# Altium project Cape.PrjPcb (part 3 of 3)
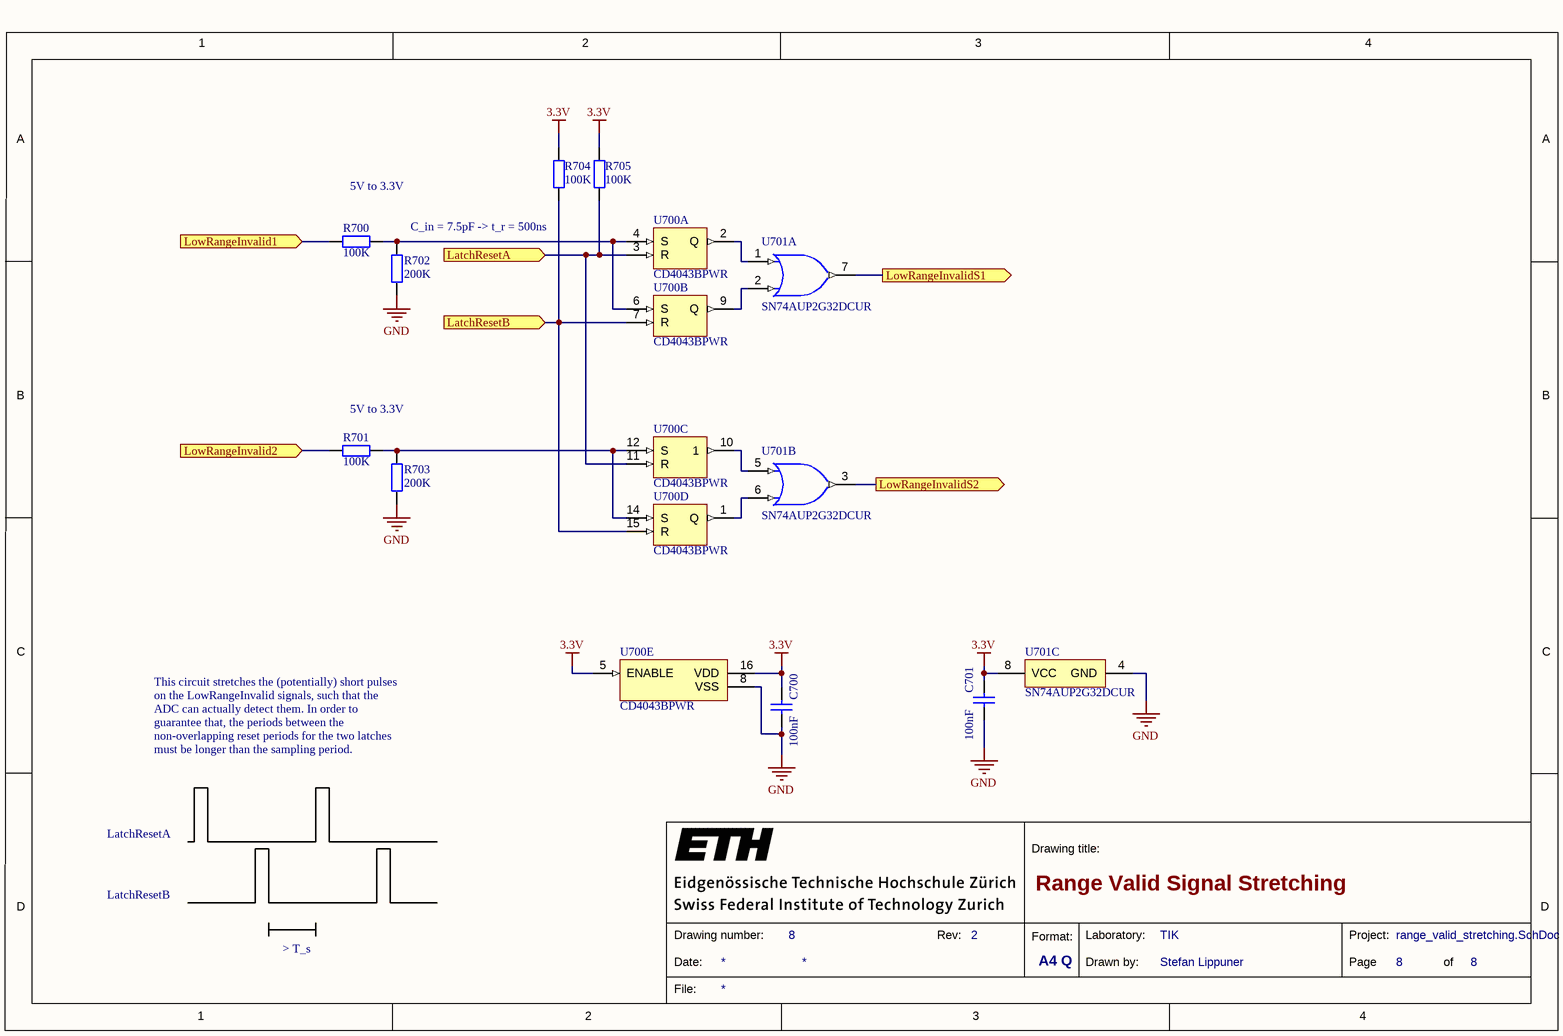
[diagram p8: range_valid_stretching.SchDoc]

## Nets that join several sheets
3.3V: ADC 1 (5 pins), psu (TP415.1), cape (14 pins), ADC 2 (5 pins), Digital Channels 1 & 2 (R600_1.2 R602_1.2), Digital Channels 3 & 4 (R600_2.2 R602_2.2), Digital Channels 5 & 6 (R600_3.2 R602_3.2), range_valid_stretching (7 pins)
5V: Current Channel 1 (9 pins), psu (C428.2 TP407.1 U406.3), Current Channel 2 (9 pins)
+2.5V: ADC 1 (16 pins), psu (6 pins), ADC 2 (16 pins)
+6.8V: psu (10 pins), Digital Channels 1 & 2 (C600_1.2 U600_1#1.8 U600_1#2.8), Digital Channels 3 & 4 (C600_2.2 U600_2#1.8 U600_2#2.8), Digital Channels 5 & 6 (C600_3.2 U600_3#1.8 U600_3#2.8)
-2.5V: ADC 1 (20 pins), psu (C431.2 TP410.1 U408.5), ADC 2 (20 pins)
-5V: Current Channel 1 (C316_1.1 C318_1.1 U305_1.4), psu (C426.2 L406.1 TP406.1 U407.4), Current Channel 2 (C316_2.1 C318_2.1 U305_2.4)
-6.8V: psu (9 pins), Digital Channels 1 & 2 (C600_1.1 U600_1#1.4 U600_1#2.4), Digital Channels 3 & 4 (C600_2.1 U600_2#1.4 U600_2#2.4), Digital Channels 5 & 6 (C600_3.1 U600_3#1.4 U600_3#2.4)
GND: top (J1.7 S1.1), Current Channel 1 (39 pins), ADC 1 (24 pins), psu (55 pins), cape (13 pins), Voltage Channels 3 & 4 (C500_1.1 C501_1.2 U500_1#2.10 U500_1#2.12), Current Channel 2 (39 pins), Voltage Channels 1 & 2 (C500_2.1 C501_2.2 U500_2#2.10 U500_2#2.12), ADC 2 (24 pins), range_valid_stretching (6 pins)
V_RAW: psu (L400.1 TP412.1), cape (U200.907 U200.908)
V_TH_D: psu (C406.2 R401.2 TP400.1), Digital Channels 1 & 2 (U600_1#1.6 U600_1#2.2), Digital Channels 3 & 4 (U600_2#1.6 U600_2#2.2), Digital Channels 5 & 6 (U600_3#1.6 U600_3#2.2)
VCCA+: Current Channel 1 (11 pins), psu (7 pins), Voltage Channels 3 & 4 (C500_1.2 U500_1#1.4 U500_1#2.4), Current Channel 2 (11 pins), Voltage Channels 1 & 2 (C500_2.2 U500_2#1.4 U500_2#2.4)
VCCA-: Current Channel 1 (11 pins), psu (7 pins), Voltage Channels 3 & 4 (C501_1.1 U500_1#1.11 U500_1#2.11), Current Channel 2 (11 pins), Voltage Channels 1 & 2 (C501_2.1 U500_2#1.11 U500_2#2.11)
VCOMP+: Current Channel 1 (R317_1.1), psu (C416.2 R408.1 R409.2 TP404.1), Current Channel 2 (R317_2.1)
VCOMP-: Current Channel 1 (R317_1.3), psu (C416.1 R410.1 TP405.1 U400.7), Current Channel 2 (R317_2.3)
VIN_POS: psu (C437.2 L401.1 Q400.3), cape (LED200.2)
DigitalInput1: ADC 1 (U100_1.44), cape (U201.2), Digital Channels 1 & 2 (R600_1.1 R601_1.2)
DigitalInput2: ADC 1 (U100_1.45), cape (U201.4), Digital Channels 1 & 2 (R602_1.1 R603_1.2)
DigitalInput3: ADC 1 (U100_1.46), cape (U201.6), Digital Channels 3 & 4 (R600_2.1 R601_2.2)
DigitalInput4: cape (U201.10), ADC 2 (U100_2.44), Digital Channels 3 & 4 (R602_2.1 R603_2.2)
DigitalInput5: cape (U201.12), ADC 2 (U100_2.45), Digital Channels 5 & 6 (R600_3.1 R601_3.2)
DigitalInput6: cape (U201.14), ADC 2 (U100_2.46), Digital Channels 5 & 6 (R602_3.1 R603_3.2)
EnablePower: psu (R416.2 TP414.1 U401.8 U401.10), cape (U200.913)
ForceHighRange1: Current Channel 1 (R320_1.1 U307_1.1), cape (U200.911)
ForceHighRange2: cape (U200.912), Current Channel 2 (R320_2.1 U307_2.1)
NetC310_1_2: Current Channel 1 (C310_1.2 R302_1.1 R305_1.2 U302_1#1.1), ADC 1 (R104_1.2)
NetC310_2_2: Current Channel 2 (C310_2.2 R302_2.1 R305_2.2 U302_2#1.1), ADC 2 (R104_2.2)
NetC311_1_1: Current Channel 1 (6 pins), ADC 1 (R101_1.2)
NetC311_2_1: Current Channel 2 (6 pins), ADC 2 (R101_2.2)
NetJ1_1: top (J1.1), Digital Channels 1 & 2 (R604_1.2)
NetJ1_2: top (J1.2), Digital Channels 1 & 2 (R605_1.2)
NetJ1_3: top (J1.3), Digital Channels 3 & 4 (R604_2.2)
NetJ1_4: top (J1.4), Digital Channels 3 & 4 (R605_2.2)
NetJ1_5: top (J1.5), Digital Channels 5 & 6 (R604_3.2)
NetJ1_6: top (J1.6), Digital Channels 5 & 6 (R605_3.2)
NetR100_1_2: Current Channel 1 (R303_1.2 TP303_1.1 U301_1.7 U304_1.4), ADC 1 (R100_1.2)
NetR100_2_2: Current Channel 2 (R303_2.2 TP303_2.1 U301_2.7 U304_2.4), ADC 2 (R100_2.2)
NetR103_1_2: Current Channel 1 (R306_1.1 TP305_1.1 U302_1#2.7), ADC 1 (R103_1.2)
NetR103_2_2: Current Channel 2 (R306_2.1 TP305_2.1 U302_2#2.7), ADC 2 (R103_2.2)
NetR105_1_2: ADC 1 (R105_1.2), Voltage Channels 1 & 2 (R507_2.2 TP500_2.1 U500_2#2.14)
NetR105_2_2: Voltage Channels 3 & 4 (R507_1.2 TP500_1.1 U500_1#2.14), ADC 2 (R105_2.2)
NetR106_1_2: ADC 1 (R106_1.2), Voltage Channels 1 & 2 (R506_2.2 TP501_2.1 U500_2#2.8)
NetR106_2_2: Voltage Channels 3 & 4 (R506_1.2 TP501_1.1 U500_1#2.8), ADC 2 (R106_2.2)
NetR704_1: cape (U200.916), range_valid_stretching (R704.1 U700.7 U700.15)
NetR705_1: cape (U200.914), range_valid_stretching (R705.1 U700.3 U700.11)
NetU100_1_34: ADC 1 (U100_1.34), cape (U200.929), ADC 2 (U100_2.34)
NetU100_1_37: ADC 1 (U100_1.37), cape (U200.922), ADC 2 (U100_2.37)
NetU100_1_38: ADC 1 (U100_1.38), cape (U200.925), ADC 2 (U100_2.38)
NetU100_1_39: ADC 1 (U100_1.39), cape (U200.928)
NetU100_1_40: ADC 1 (U100_1.40), cape (U200.931), ADC 2 (U100_2.40)
NetU100_1_42: ADC 1 (U100_1.42), range_valid_stretching (U701.7)
NetU100_1_43: ADC 1 (U100_1.43), cape (U200.930)
NetU100_1_47: ADC 1 (U100_1.47), cape (U200.815)
NetU100_2_39: cape (U200.927), ADC 2 (U100_2.39)
NetU100_2_42: ADC 2 (U100_2.42), range_valid_stretching (U701.3)
NetU100_2_43: cape (U200.924), ADC 2 (U100_2.43)
NetU100_2_47: cape (U200.816), ADC 2 (U100_2.47)
ShortInput: Current Channel 1 (C325_1.2 Q300_1.4 R321_1.1), range_valid_stretching (R700.1)
ShortInput: Current Channel 2 (C325_2.2 Q300_2.4 R321_2.1), range_valid_stretching (R701.1)